# Altium schematic sheet dsau-adc.SchDoc: dSAU Motherboard - ADC
size Letter; Engineer: Christopher J. Woodall; Organization: Boston University EDF/ECE; DocumentNumber: 3; Revision: A; SheetNumber: 3; SheetTotal: 10; EMAIL: cwoodall@bu.edu; TeamName: Team 19; ProjectName: dSAU
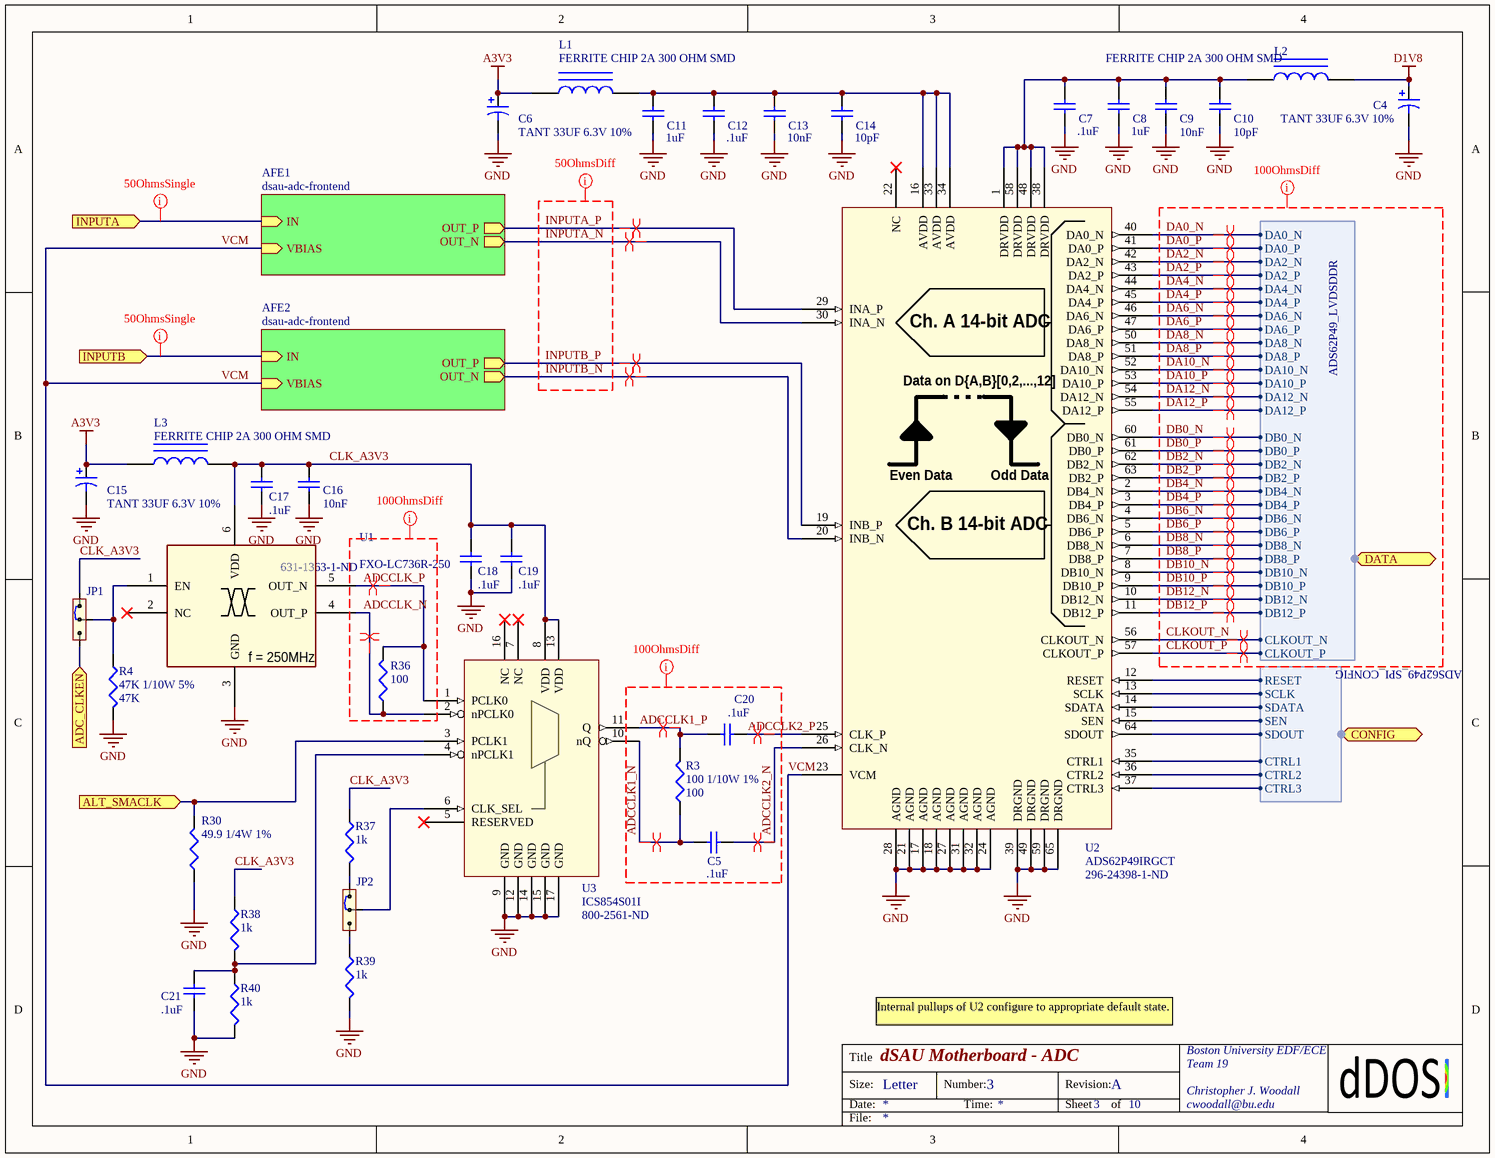
[diagram p0: dsau-adc.SchDoc]

## Parts
C4  TANT 33UF 6.3V 10%  [CAPC2012L]
C5  value .1uF  [CAPC1608L]  (hidden comment: CER 0.1UF 50V Y5V)
C6  TANT 33UF 6.3V 10%  [CAPC2012L]
C7  value .1uF  [CAPC1608L]  (hidden comment: CER 0.1UF 50V Y5V)
C8  value 1uF  [CAPC2012L]  (hidden comment: CER 1UF 16V 10% X7R)
C9  value 10nF  [CAPC1608L]  (hidden comment: CER 10NF 25V 10% NP0)
C10  value 10pF  [CAPC1608L]  (hidden comment: CER 10PF 50V 5% NP0)
C11  value 1uF  [CAPC2012L]  (hidden comment: CER 1UF 16V 10% X7R)
C12  value .1uF  [CAPC1608L]  (hidden comment: CER 0.1UF 50V Y5V)
C13  value 10nF  [CAPC1608L]  (hidden comment: CER 10NF 25V 10% NP0)
C14  value 10pF  [CAPC1608L]  (hidden comment: CER 10PF 50V 5% NP0)
C15  TANT 33UF 6.3V 10%  [CAPC2012L]
C16  value 10nF  [CAPC1608L]  (hidden comment: CER 10NF 25V 10% NP0)
C17  value .1uF  [CAPC1608L]  (hidden comment: CER 0.1UF 50V Y5V)
C18  value .1uF  [CAPC1608L]  (hidden comment: CER 0.1UF 50V Y5V)
C19  value .1uF  [CAPC1608L]  (hidden comment: CER 0.1UF 50V Y5V)
C20  value .1uF  [CAPC1608L]  (hidden comment: CER 0.1UF 50V Y5V)
C21  value .1uF  [CAPC1608L]  (hidden comment: CER 0.1UF 50V Y5V)
JP1  JUMPER_2WAY  [HDR1X3]  (value not drawn)
JP2  JUMPER_2WAY  [HDR1X3]  (value not drawn)
L1  FERRITE CHIP 2A 300 OHM SMD  [INDC1608L]
L2  FERRITE CHIP 2A 300 OHM SMD  [INDC1608L]
L3  FERRITE CHIP 2A 300 OHM SMD  [INDC1608L]
R3  100 1/10W 1%  value 100  [RESC1608L]
R4  47K 1/10W 5%  value 47K  [RESC1608L]
R30  49.9 1/4W 1%  [RESC3216L]
R36  value 100  [RESC1608L]  (hidden comment: 100 1/10W 1%)
R37  value 1k  [RESC1608L]  (hidden comment: 100 1/10W 1%)
R38  value 1k  [RESC1608L]  (hidden comment: 100 1/10W 1%)
R39  value 1k  [RESC1608L]  (hidden comment: 100 1/10W 1%)
R40  value 1k  [RESC1608L]  (hidden comment: 100 1/10W 1%)
U1  Supplier Part Number 1: 631-1363-1-ND  Manufacturer Part Number: FXO-LC736R-250  [FXO-LC736R-SMD_6]  (hidden comment: FXO-LC736R-250MHz)
U2  Manufacturer Part Number: ADS62P49IRGCT  Supplier Part Number 1: 296-24398-1-ND  [VQFN-64]  (hidden comment: ADS62P49_SINGLE)
U3  ICS854S01I  Supplier Part Number 1: 800-2561-ND  [VFQFN16_CUSTOM]

## Sub-sheets
AFE1 = dsau-adc-frontend: IN (in), OUT_P (out), OUT_N (out), VBIAS (in)
AFE2 = dsau-adc-frontend: IN (in), OUT_P (out), OUT_N (out), VBIAS (in)

## Ports
ADC_CLKEN (in), ALT_SMACLK (in), CONFIG (harness ADS62P49_SPI_CONFIG), DATA (harness ADS62P49_LVDSDDR), INPUTA (in), INPUTB (in)

## Harnesses
ADS62P49_LVDSDDR: DA0_N, DA2_N, DA4_N, DA6_N, DA8_N, DA10_N, DA12_N, DA0_P, DA2_P, DA4_P, DA6_P, DA8_P, DA10_P, DA12_P, DB0_N, DB2_N, DB4_N, DB6_N, DB8_N, DB10_N, DB12_N, DB0_P, DB2_P, DB4_P, DB6_P, DB8_P, DB10_P, DB12_P, CLKOUT_P, CLKOUT_N
ADS62P49_SPI_CONFIG: RESET, SCLK, SDATA, SEN, SDOUT, CTRL1, CTRL2, CTRL3

## Nets
A3V3: C6.1 C15.1 L1.2 L3.2
D1V8: C4.1 L2.1
GND: C4.2 C6.2 C7.2 C8.2 C9.2 C10.2 C11.2 C12.2 C13.2 C14.2 C15.2 C16.2 C17.2 C18.2 C19.2 C21.2 R4.2 R30.1 R39.2 R40.2 U1.3(GND) U2.17(AGND) U2.18(AGND) U2.21(AGND) U2.24(AGND) U2.27(AGND) U2.28(AGND) U2.31(AGND) U2.32(AGND) U2.39(DRGND) U2.49(DRGND) U2.59(DRGND) U2.65(DRGND) U3.9(GND) U3.12(GND) U3.14(GND) U3.15(GND) U3.17(GND)
ADC_CLKEN: JP1.3 ; port ADC_CLKEN
ADCCLK1_N: C5.1 R3.1 U3.10(nQ)
ADCCLK1_P: C20.1 R3.2 U3.11(Q)
ADCCLK2_N: C5.2 U2.26(CLK_N)
ADCCLK2_P: C20.2 U2.25(CLK_P)
ADCCLK_N: R36.1 U1.4(OUT_P) U3.2(nPCLK0)
ADCCLK_P: R36.2 U1.5(OUT_N) U3.1(PCLK0)
ALT_SMACLK: R30.2 U3.3(PCLK1) ; port ALT_SMACLK
CLK_A3V3: C16.1 C17.1 C18.1 C19.1 JP1.1 L3.1 R37.1 R38.1 U1.6(VDD) U3.8(VDD) U3.13(VDD)
CLKOUT_N: U2.56(CLKOUT_N) ; port DATA.CLKOUT_N
CLKOUT_P: U2.57(CLKOUT_P) ; port DATA.CLKOUT_P
DA0_N: U2.40(DA0_N) ; port DATA.DA0_N
DA0_P: U2.41(DA0_P) ; port DATA.DA0_P
DA2_N: U2.42(DA2_N) ; port DATA.DA2_N
DA2_P: U2.43(DA2_P) ; port DATA.DA2_P
DA4_N: U2.44(DA4_N) ; port DATA.DA4_N
DA4_P: U2.45(DA4_P) ; port DATA.DA4_P
DA6_N: U2.46(DA6_N) ; port DATA.DA6_N
DA6_P: U2.47(DA6_P) ; port DATA.DA6_P
DA8_N: U2.50(DA8_N) ; port DATA.DA8_N
DA8_P: U2.51(DA8_P) ; port DATA.DA8_P
DA10_N: U2.52(DA10_N) ; port DATA.DA10_N
DA10_P: U2.53(DA10_P) ; port DATA.DA10_P
DA12_N: U2.54(DA12_N) ; port DATA.DA12_N
DA12_P: U2.55(DA12_P) ; port DATA.DA12_P
DB0_N: U2.60(DB0_N) ; port DATA.DB0_N
DB0_P: U2.61(DB0_P) ; port DATA.DB0_P
DB2_N: U2.62(DB2_N) ; port DATA.DB2_N
DB2_P: U2.63(DB2_P) ; port DATA.DB2_P
DB4_N: U2.2(DB4_N) ; port DATA.DB4_N
DB4_P: U2.3(DB4_P) ; port DATA.DB4_P
DB6_N: U2.4(DB6_N) ; port DATA.DB6_N
DB6_P: U2.5(DB6_P) ; port DATA.DB6_P
DB8_N: U2.6(DB8_N) ; port DATA.DB8_N
DB8_P: U2.7(DB8_P) ; port DATA.DB8_P
DB10_N: U2.8(DB10_N) ; port DATA.DB10_N
DB10_P: U2.9(DB10_P) ; port DATA.DB10_P
DB12_N: U2.10(DB12_N) ; port DATA.DB12_N
DB12_P: U2.11(DB12_P) ; port DATA.DB12_P
INPUTA: port INPUTA, sheet AFE1/IN
INPUTA_N: U2.30(INA_N) ; sheet AFE1/OUT_N
INPUTA_P: U2.29(INA_P) ; sheet AFE1/OUT_P
INPUTB: port INPUTB, sheet AFE2/IN
INPUTB_N: U2.20(INB_N) ; sheet AFE2/OUT_N
INPUTB_P: U2.19(INB_P) ; sheet AFE2/OUT_P
VCM: U2.23(VCM) ; sheet AFE1/VBIAS, sheet AFE2/VBIAS
NetC7_1: C7.1 C8.1 C9.1 C10.1 L2.2 U2.1(DRVDD) U2.38(DRVDD) U2.48(DRVDD) U2.58(DRVDD)
NetC11_1: C11.1 C12.1 C13.1 C14.1 L1.1 U2.16(AVDD) U2.33(AVDD) U2.34(AVDD)
NetC21_1: C21.1 R38.2 R40.1 U3.4(nPCLK1)
NetJP1_2: JP1.2 R4.1 U1.1(EN)
NetJP2_1: JP2.1 R37.2
NetJP2_2: JP2.2 U3.6(CLK_SEL)
NetJP2_3: JP2.3 R39.1
NetU2_12: U2.12(RESET) ; port CONFIG.RESET
NetU2_13: U2.13(SCLK) ; port CONFIG.SCLK
NetU2_14: U2.14(SDATA) ; port CONFIG.SDATA
NetU2_15: U2.15(SEN) ; port CONFIG.SEN
NetU2_35: U2.35(CTRL1) ; port CONFIG.CTRL1
NetU2_36: U2.36(CTRL2) ; port CONFIG.CTRL2
NetU2_37: U2.37(CTRL3) ; port CONFIG.CTRL3
NetU2_64: U2.64(SDOUT) ; port CONFIG.SDOUT

Not connected (* = marked no-connect by the designer): U1 2(NC)*; U2 22(NC)*; U3 5(RESERVED)* 7(NC)* 16(NC)*

## Layout directives
differential pair: ADCCLK1_N, ADCCLK1_P, ADCCLK2_N, ADCCLK2_P, ADCCLK_N, ADCCLK_P, CLKOUT_N, CLKOUT_P, DA0_N, DA0_P, DA2_N, DA2_P, DA4_N, DA4_P, DA6_N, DA6_P, DA8_N, DA8_P, DA10_N, DA10_P, DA12_N, DA12_P, DB0_N, DB0_P, DB2_N, DB2_P, DB4_N, DB4_P, DB6_N, DB6_P, DB8_N, DB8_P, DB10_N, DB10_P, DB12_N, DB12_P, INPUTA_N, INPUTA_P, INPUTB_N, INPUTB_P
net class 100OhmsDiff: ADCCLK1_N, ADCCLK1_P, ADCCLK2_N, ADCCLK2_P, ADCCLK_N, ADCCLK_P, CLKOUT_N, CLKOUT_P, DA0_N, DA0_P, DA2_N, DA2_P, DA4_N, DA4_P, DA6_N, DA6_P, DA8_N, DA8_P, DA10_N, DA10_P, DA12_N, DA12_P, DB0_N, DB0_P, DB2_N, DB2_P, DB4_N, DB4_P, DB6_N, DB6_P, DB8_N, DB8_P, DB10_N, DB10_P, DB12_N, DB12_P
net class 50OhmsDiff: INPUTA_N, INPUTA_P, INPUTB_N, INPUTB_P
net class 50OhmsSingle: INPUTA, INPUTB

## Notes on the sheet
- Internal pullups of U2 configure to appropriate default state.
  In case where RESET is pulled low all possible valid states (for our application) are available by pulling SCLK, SDATA, SEN low.
- Title
- Size:
- Date:
- Letter
- Number:
- Time:
- Revision:
- Sheet
- of
- File:
- (in symbol ADS62P49_SINGLE) Ch. A 14-bit ADC; Data on D{A,B}[0,2,...,12]; Even Data; Odd Data; Ch. B 14-bit ADC
- (in symbol FXO-LC736R-250MHz) f = 250MHz

## Library data of the parts
C4 C6 C15 = Cap Pol3: Polarized Capacitor (Surface Mount); Manufacturer: AVX Corporation; Manufacturer Part Number: TPSA336K006R0600; Published: 8-Jun-2000; LatestRevisionDate: 29-May-2009; LatestRevisionNote: IPC-7351 Footprint Added.; PackageReference: C1206; Publisher: Altium Limited; PackageDescription: Chip Capacitor; Value: 33uF; Supplier 1: Digi-Key; Supplier Part Number 1: 478-1755-1-ND
C5 C7 C12 C17-C21 = Cap: Capacitor; Manufacturer: Yageo; Manufacturer Part Number: CC0603ZRY5V9BB104; Published: 8-Jun-2000; LatestRevisionDate: 17-Jul-2002; LatestRevisionNote: Re-released for DXP Platform.; PackageReference: RAD-0.3; Publisher: Altium Limited; Supplier 1: Digi-Key; Supplier Part Number 1: 311-1343-1-ND
C8 C11 = Cap: Capacitor; Manufacturer: Yageo; Manufacturer Part Number: CC0805KKX7R7BB105; Published: 8-Jun-2000; LatestRevisionDate: 17-Jul-2002; LatestRevisionNote: Re-released for DXP Platform.; PackageReference: RAD-0.3; Publisher: Altium Limited; Supplier 1: Digi-Key; Supplier Part Number 1: 311-1365-1-ND
C9 C13 C16 = Cap: Capacitor; Manufacturer: Kemet; Manufacturer Part Number: C0603C103K3GACTU; Published: 8-Jun-2000; LatestRevisionDate: 17-Jul-2002; LatestRevisionNote: Re-released for DXP Platform.; PackageReference: RAD-0.3; Publisher: Altium Limited; Supplier 1: Digi-Key; Supplier Part Number 1: 399-8987-1-ND
C10 C14 = Cap: Capacitor; Manufacturer: Samsung Electro-Mechanics America, Inc; Manufacturer Part Number: CL10C100JB8NCNC; Published: 8-Jun-2000; LatestRevisionDate: 17-Jul-2002; LatestRevisionNote: Re-released for DXP Platform.; PackageReference: RAD-0.3; Publisher: Altium Limited; Supplier 1: Digi-Key; Supplier Part Number 1: 1276-2154-1-ND
L1-L3 = Inductor Iron: Magnetic-Core Inductor; Manufacturer: Laird-Signal Integrity Products; Manufacturer Part Number: MI0603L301R-10; Value: 2A 300 OHM @ 100MHz; Published: 24-Mar-1999; LatestRevisionDate: 17-Jul-2002; LatestRevisionNote: Re-released for DXP Platform.; PackageReference: AXIAL-0.9; Publisher: Altium Limited; Supplier 1: Digi-Key; Supplier Part Number 1: 240-2374-1-ND
R3 R36 = Res3: Resistor; Manufacturer: Yageo; Manufacturer Part Number: RC0603FR-07100RL; Published: 8-Jun-2000; LatestRevisionDate: 29-May-2009; LatestRevisionNote: IPC-7351 Footprint Added.; PackageReference: J1-0603; Publisher: Altium Limited; PackageDescription: Chip Resistor; Supplier 1: Digi-Key; Supplier Part Number 1: 311-100HRCT-ND
R4 = Res3: Resistor; Manufacturer: Yageo; Manufacturer Part Number: 311-47kGRCT-ND; Published: 8-Jun-2000; LatestRevisionDate: 29-May-2009; LatestRevisionNote: IPC-7351 Footprint Added.; PackageReference: J1-0603; Publisher: Altium Limited; PackageDescription: Chip Resistor; Supplier 1: Digi-Key; Supplier Part Number 1: 311-47KGRTR-ND
R30 = Res3: Resistor; Manufacturer: Panasonic Electronic Components; Manufacturer Part Number: ERJ-8ENF49R9V; Value: 49.9; Published: 8-Jun-2000; LatestRevisionDate: 29-May-2009; LatestRevisionNote: IPC-7351 Footprint Added.; PackageReference: J1-0603; Publisher: Altium Limited; PackageDescription: Chip Resistor; Supplier 1: Digi-Key; Supplier Part Number 1: P49.9FCT-ND
R37-R40 = Res3: Resistor; Manufacturer: Yageo; Manufacturer Part Number: RC0603JR-071KL; Published: 8-Jun-2000; LatestRevisionDate: 29-May-2009; LatestRevisionNote: IPC-7351 Footprint Added.; PackageReference: J1-0603; Publisher: Altium Limited; PackageDescription: Chip Resistor; Supplier 1: Digi-Key; Supplier Part Number 1: 311-1.0KGRCT-ND
U1 = FXO-LC736R-250MHz: OSC 250 MHZ 3.3V LVDS SMD; Manufacturer: Fox Electronics; Supplier 1: Digi-Key
U2 = ADS62P49_SINGLE: IC ADC DUAL 14BIT 250MSPS 64VQFN; Manufacturer: Texas Instruments; Supplier 1: Digi-key
U3 = ICS854S01I: Supplier 1: Digi-Key